# Altium schematic sheet USB.SchDoc
size A4
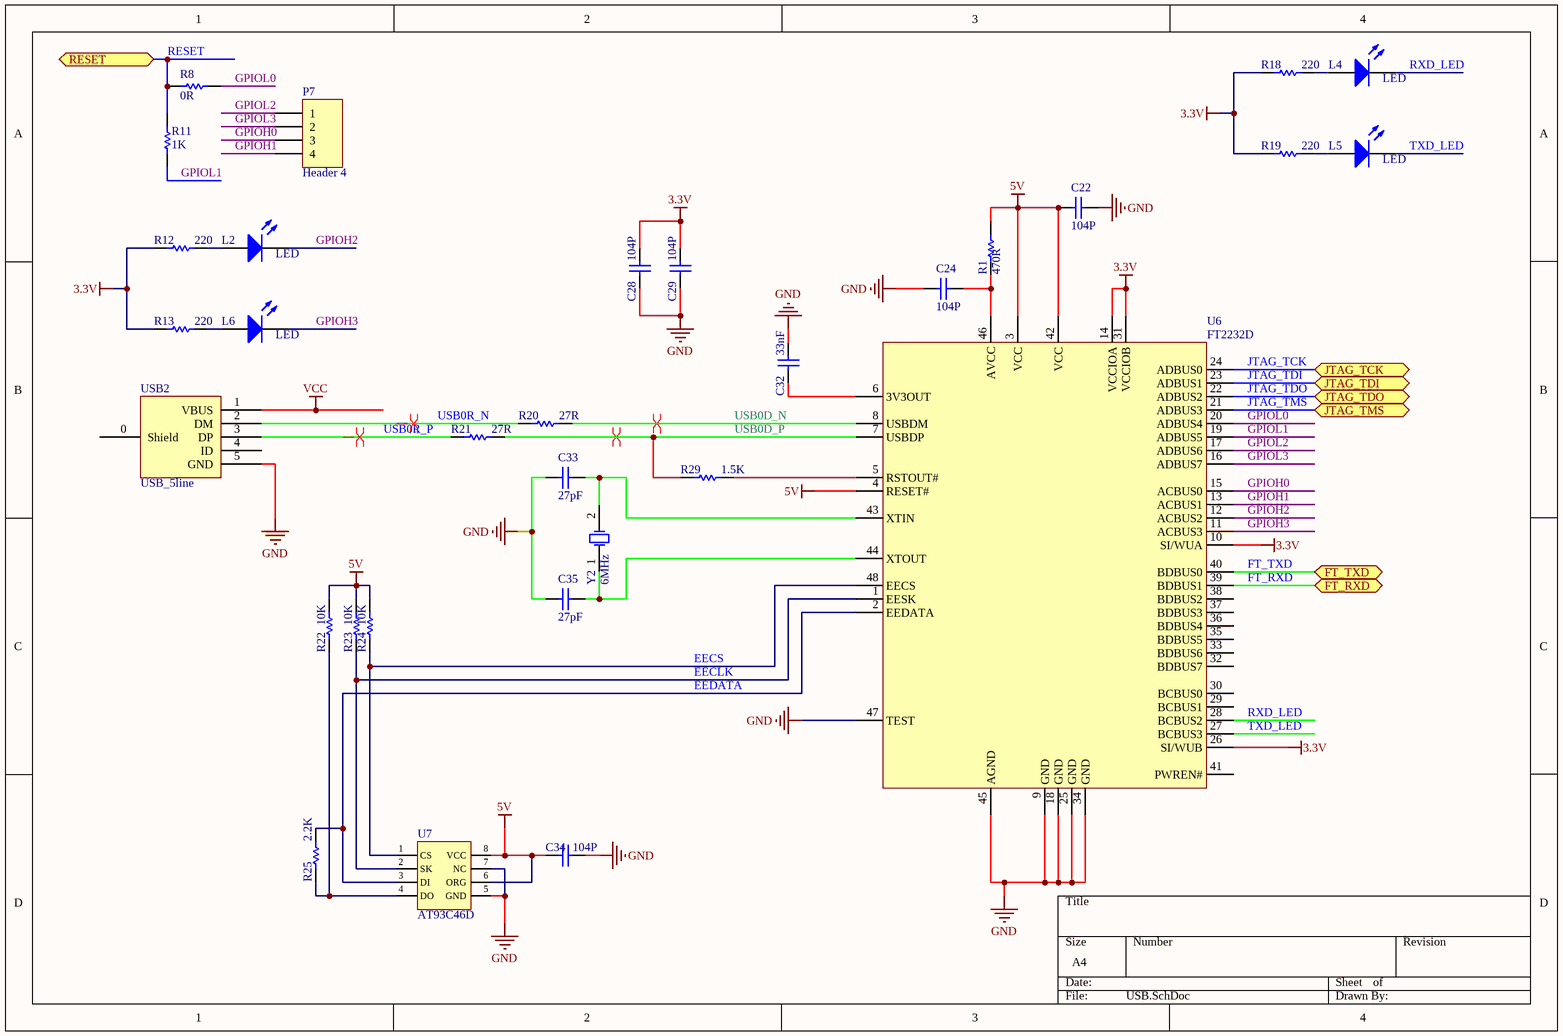
[diagram p0: USB.SchDoc]

## Parts
C22  value 104P  [1608[0603]]  (hidden comment: Cap)
C24  value 104P  [1608[0603]]  (hidden comment: Cap)
C28  value 104P  [1608[0603]]  (hidden comment: Cap)
C29  value 104P  [1608[0603]]  (hidden comment: Cap)
C32  value 33nF  [1608[0603]]  (hidden comment: Cap)
C33  value 27pF  [1608[0603]]  (hidden comment: Cap)
C34  value 104P  [1608[0603]]  (hidden comment: Cap)
C35  value 27pF  [1608[0603]]  (hidden comment: Cap)
L2  LED  [1608[0603]]
L4  LED  [1608[0603]]
L5  LED  [1608[0603]]
L6  LED  [1608[0603]]
P7  Header 4  [HDR1X4]
R1  value 470R  [1608[0603]]  (hidden comment: Res)
R8  value 0R  [1608[0603]]  (hidden comment: Res)
R11  value 1K  [1608[0603]]  (hidden comment: Res)
R12  value 220  [1608[0603]]  (hidden comment: Res)
R13  value 220  [1608[0603]]  (hidden comment: Res)
R18  value 220  [1608[0603]]  (hidden comment: Res)
R19  value 220  [1608[0603]]  (hidden comment: Res)
R20  value 27R  [1608[0603]]  (hidden comment: Res)
R21  value 27R  [1608[0603]]  (hidden comment: Res)
R22  value 10K  [1608[0603]]  (hidden comment: Res)
R23  value 10K  [1608[0603]]  (hidden comment: Res)
R24  value 10K  [1608[0603]]  (hidden comment: Res)
R25  value 2.2K  [1608[0603]]  (hidden comment: Res)
R29  value 1.5K  [1608[0603]]  (hidden comment: Res)
U6  FT2232D  [TSQFP50P900X900X160-48N]
U7  AT93C46D  [TSOP65P640X120-8N-AT93C46D]
USB2  USB_5line  [USB-MICRO-5P-2F]
Y2  6MHz  [XTAL-RAD-0.2]

## Ports
FT_RXD, FT_TXD, JTAG_TCK, JTAG_TDI, JTAG_TDO, JTAG_TMS, RESET

## Nets
3.3V: C28.2 C29.2 R12.2 R13.2 R18.2 R19.2 U6.10(SI/WUA) U6.14(VCCIOA) U6.26(SI/WUB) U6.31(VCCIOB)
5V: C22.2 C34.2 R1.1 R22.1 R23.1 R24.1 U6.3(VCC) U6.4(RESET#) U6.42(VCC) U7.6(ORG) U7.8(VCC)
GND: C22.1 C24.2 C28.1 C29.1 C32.2 C33.1 C34.1 C35.2 U6.9(GND) U6.18(GND) U6.25(GND) U6.34(GND) U6.45(AGND) U6.47(TEST) U7.5(GND) U7.7(NC) USB2.5(GND)
VCC: USB2.1(VBUS)
EECLK: R23.2 U6.1(EESK) U7.2(SK)
EECS: R24.2 U6.48(EECS) U7.1(CS)
EEDATA: R25.1 U6.2(EEDATA) U7.3(DI)
FT_RXD: U6.39(BDBUS1) ; port FT_RXD
FT_TXD: U6.40(BDBUS0) ; port FT_TXD
GPIOH0: P7.3 U6.15(ACBUS0)
GPIOH1: P7.4 U6.13(ACBUS1)
GPIOH2: L2.2(K) U6.12(ACBUS2)
GPIOH3: L6.2(K) U6.11(ACBUS3)
GPIOL0: R8.2 U6.20(ADBUS4)
GPIOL1: R11.2 U6.19(ADBUS5)
GPIOL2: P7.1 U6.17(ADBUS6)
GPIOL3: P7.2 U6.16(ADBUS7)
JTAG_TCK: U6.24(ADBUS0) ; port JTAG_TCK
JTAG_TDI: U6.23(ADBUS1) ; port JTAG_TDI
JTAG_TDO: U6.22(ADBUS2) ; port JTAG_TDO
JTAG_TMS: U6.21(ADBUS3) ; port JTAG_TMS
RESET: R8.1 R11.1 ; port RESET
RXD_LED: L4.2(K) U6.28(BCBUS2)
TXD_LED: L5.2(K) U6.27(BCBUS3)
USB0D_N: R20.2 U6.8(USBDM)
USB0D_P: R21.2 R29.1 U6.7(USBDP)
USB0R_N: R20.1 USB2.2(DM)
USB0R_P: R21.1 USB2.3(DP)
NetC24_1: C24.1 R1.2 U6.46(AVCC)
NetC32_1: C32.1 U6.6(3V3OUT)
NetC33_2: C33.2 U6.43(XTIN) Y2.2(OSC2)
NetC35_1: C35.1 U6.44(XTOUT) Y2.1(OSC1)
NetL2_1: L2.1(A) R12.1
NetL4_1: L4.1(A) R18.1
NetL5_1: L5.1(A) R19.1
NetL6_1: L6.1(A) R13.1
NetR22_2: R22.2 R25.2 U7.4(DO)
NetR29_2: R29.2 U6.5(RSTOUT#)

Not connected (* = marked no-connect by the designer): U6 29(BCBUS1) 30(BCBUS0) 32(BDBUS7) 33(BDBUS6) 35(BDBUS5) 36(BDBUS4) 37(BDBUS3) 38(BDBUS2) 41(PWREN#); USB2 0(Shield) 4(ID)

## Layout directives
differential pair: USB0D_N, USB0D_P, USB0R_N, USB0R_P

## Library data of the parts
C22 C24 C28 C29 C32-C35 = Cap: 贴片电容; Published: 8-Jun-2000; LatestRevisionDate: 17-Jul-2002; LatestRevisionNote: Re-released for DXP Platform.; PackageReference: RAD-0.3; Publisher: Altium Limited
P7 = Header 4: Header, 4-Pin; LatestRevisionDate: 17-Jul-2002; LatestRevisionNote: Re-released for DXP Platform.; Publisher: Altium Limited
R1 R8 R11-R13 R18-R25 R29 = Res: 贴片电阻; Published: 8-Jun-2000; LatestRevisionDate: 17-Jul-2002; LatestRevisionNote: Re-released for DXP Platform.; PackageReference: AXIAL-0.3; Publisher: Altium Limited
Y2 = XTAL: 晶体振荡器; Published: 8-Jun-2000; LatestRevisionDate: 17-Jul-2002; LatestRevisionNote: Re-released for DXP Platform.; PackageReference: R38; Publisher: Altium Limited